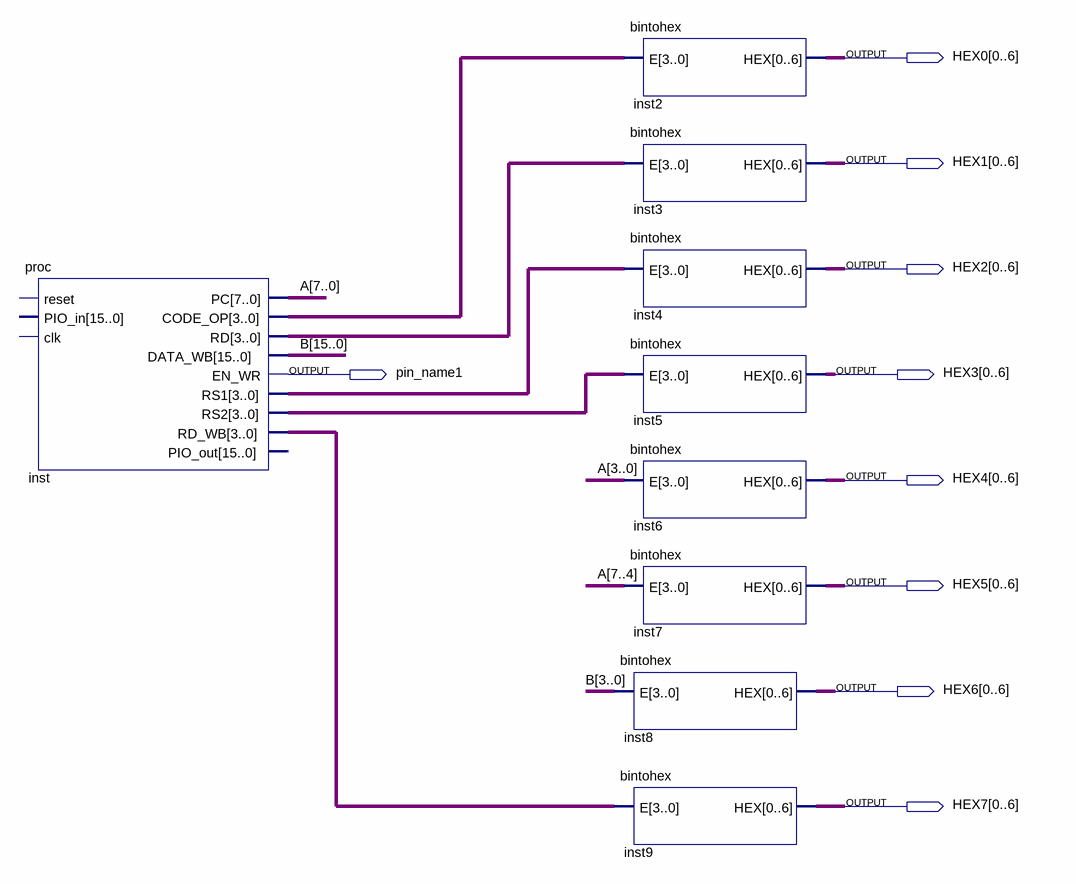
[diagram p0: schematic sheet]
// Quartus schematic Block1.bdf as structural Verilog: 9 symbols, 9 pins
module Block1 (
  output [0:6] HEX0,
  output [0:6] HEX1,
  output [0:6] HEX2,
  output pin_name1,
  output [0:6] HEX3,
  output [0:6] HEX4,
  output [0:6] HEX5,
  output [0:6] HEX6,
  output [0:6] HEX7
);

  wire [3:0] inst_code_op, inst_rd, inst_rd_wb, inst_rs1, inst_rs2;
  wire [7:0] A;
  wire [15:0] B;

  proc inst (
    .PC(A), .CODE_OP(inst_code_op), .RD(inst_rd), .DATA_WB(B), .EN_WR(pin_name1), .RS1(inst_rs1),
    .RS2(inst_rs2), .RD_WB(inst_rd_wb));  // open: reset, PIO_in, clk, PIO_out
  bintohex inst2 (.E(inst_code_op), .HEX(HEX0));
  bintohex inst3 (.E(inst_rd), .HEX(HEX1));
  bintohex inst4 (.E(inst_rs1), .HEX(HEX2));
  bintohex inst5 (.E(inst_rs2), .HEX(HEX3));
  bintohex inst6 (.E(A[3:0]), .HEX(HEX4));
  bintohex inst7 (.E(A[7:4]), .HEX(HEX5));
  bintohex inst8 (.E(B[3:0]), .HEX(HEX6));
  bintohex inst9 (.E(inst_rd_wb), .HEX(HEX7));
endmodule
